# Altium project 姿态记录仪.PrjPcb
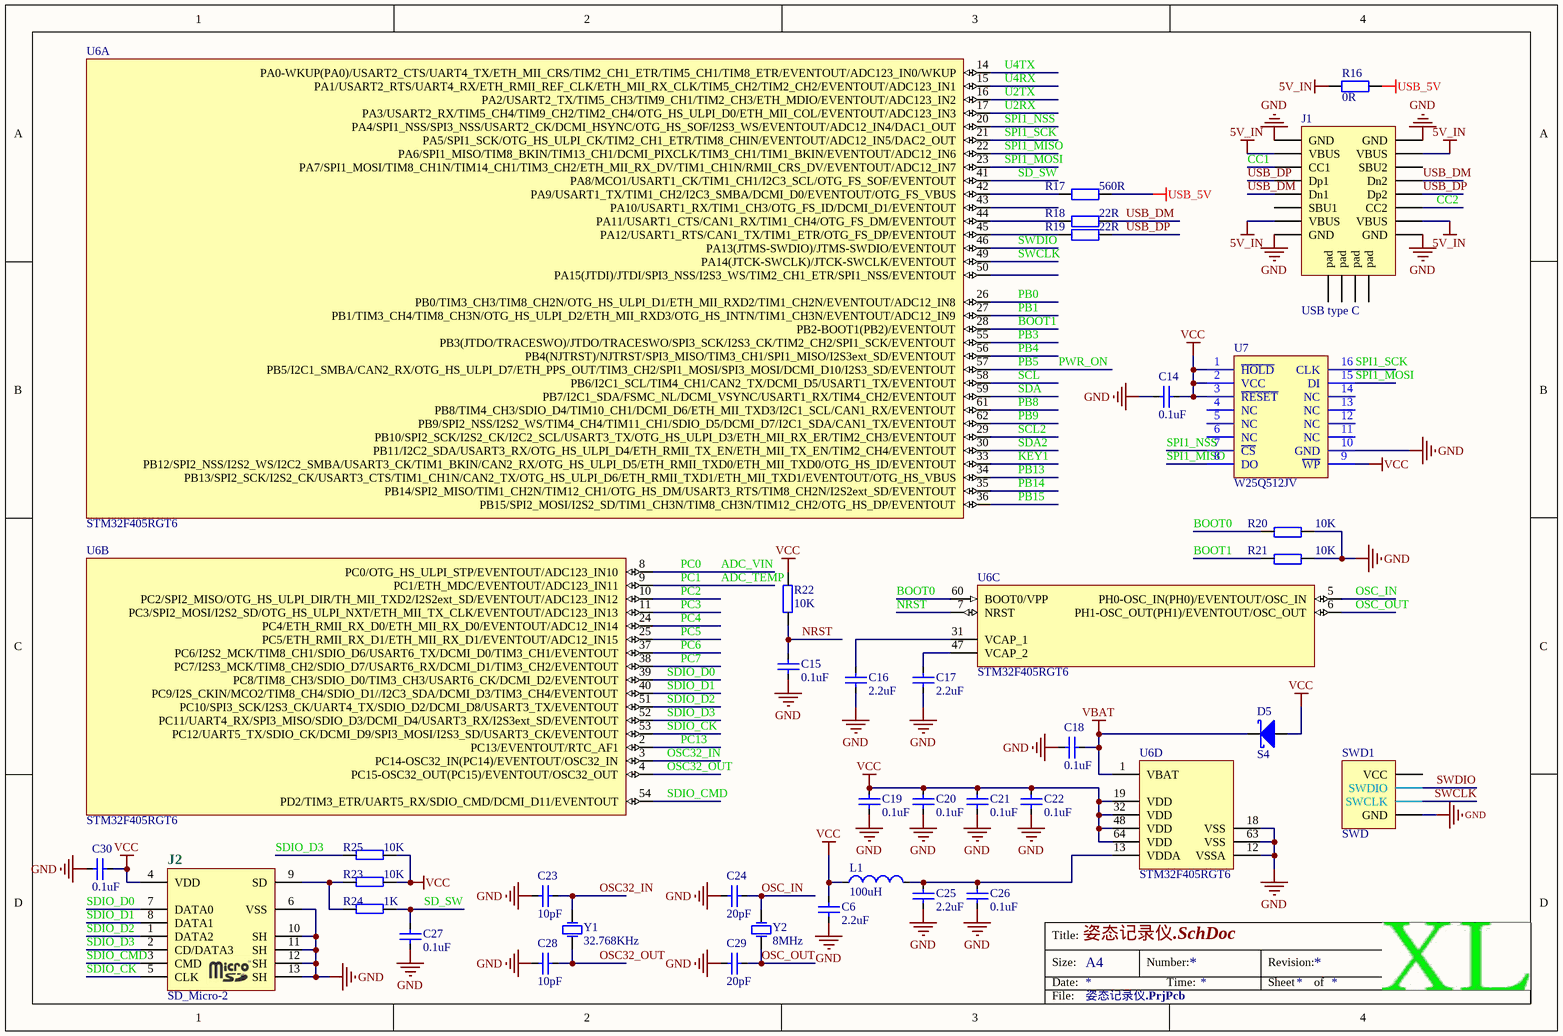
[diagram p0: 姿态记录仪.SchDoc]
2 sheets, 92 parts. Net scope: global (net labels, ports and power ports of the same name join across sheets).
Board file: 姿态记录仪.PcbDoc
Sheets:
  姿态记录仪.SchDoc
  Sensor.SchDoc

## Sheet 姿态记录仪.SchDoc
size A4

### Parts
C6  value 2.2uF  [CAP_0603]  (hidden comment: Cap_0603)
C14  value 0.1uF  [CAP_0603]  (hidden comment: Cap_0603)
C15  value 0.1uF  [CAP_0603]  (hidden comment: Cap_0603)
C16  value 2.2uF  [CAP_0603]  (hidden comment: Cap_0603)
C17  value 2.2uF  [CAP_0603]  (hidden comment: Cap_0603)
C18  value 0.1uF  [CAP_0603]  (hidden comment: Cap_0603)
C19  value 0.1uF  [CAP_0603]  (hidden comment: Cap_0603)
C20  value 0.1uF  [CAP_0603]  (hidden comment: Cap_0603)
C21  value 0.1uF  [CAP_0603]  (hidden comment: Cap_0603)
C22  value 0.1uF  [CAP_0603]  (hidden comment: Cap_0603)
C23  value 10pF  [CAP_0603]  (hidden comment: Cap_0603)
C24  value 20pF  [CAP_0603]  (hidden comment: Cap_0603)
C25  value 2.2uF  [CAP_0603]  (hidden comment: Cap_0603)
C26  value 0.1uF  [CAP_0603]  (hidden comment: Cap_0603)
C27  value 0.1uF  [CAP_0603]  (hidden comment: Cap_0603)
C28  value 10pF  [CAP_0603]  (hidden comment: Cap_0603)
C29  value 20pF  [CAP_0603]  (hidden comment: Cap_0603)
C30  value 0.1uF  [CAP_0603]  (hidden comment: Cap_0603)
D5  S4  [SOD323]
J1  USB type C  [USB Type-C-16Pin_A]
J2  SD_Micro-2  [TF-Miroc_SD_1]
L1  value 100uH  [IND_0603]  (hidden comment: Ind_0603)
R16  value 0R  [RES_0603]  (hidden comment: 1A保险丝)
R17  value 560R  [RES_0603]  (hidden comment: Res_0603)
R18  value 22R  [RES_0603]  (hidden comment: Res_0603)
R19  value 22R  [RES_0603]  (hidden comment: Res_0603)
R20  10K  [RES_0603]
R21  10K  [RES_0603]
R22  10K  [RES_0603]
R23  10K  [RES_0603]
R24  1K  [RES_0603]
R25  10K  [RES_0603]
SWD1  SWD  [BHDR4]
U6  STM32F405RGT6  [TQFP64_V]  (parts A,B,C,D of 4)
U7  W25Q512JV  [SOL-16]
Y1  32.768KHz  [XTAL32]
Y2  8MHz  [XTAL_5032]

### Nets
5V_IN: J1.A4(VBUS) J1.A9(VBUS) J1.B4(VBUS) J1.B9(VBUS) R16.2
GND: C6.1 C14.2 C15.1 C16.1 C17.1 C18.1 C19.1 C20.1 C21.1 C22.1 C23.2 C24.2 C25.1 C26.1 C27.1 C28.2 C29.2 C30.2 J1.A1(GND) J1.A12(GND) J1.B1(GND) J1.B12(GND) J2.6(VSS) J2.10(SH) J2.11(SH) J2.12(SH) J2.13(SH) R20.2 R21.2 SWD1.4(GND) U6.12(VSSA) U6.18(VSS) U6.63(VSS) U7.10(GND) Y1.3(PAD) Y2.3(PAD)
USB_5V: R16.1 R17.2
VBAT: C18.2 D5.2(K) U6.1(VBAT)
VCC: C6.2 C14.1 C19.2 C20.2 C21.2 C22.2 C30.1 D5.1(A) J2.4(VDD) L1.1 R22.1 R23.1 R25.1 U6.19(VDD) U6.32(VDD) U6.48(VDD) U6.64(VDD) U7.1(~{HOLD}) U7.2(VCC) U7.3(~{RESET}) U7.9(~{WP})
ADC_TEMP: U6.9(PC1/ETH_MDC/EVENTOUT/ADC123_IN11)  [also labelled PC1]
ADC_VIN: U6.8(PC0/OTG_HS_ULPI_STP/EVENTOUT/ADC123_IN10)  [also labelled PC0]
BOOT0: R20.1 U6.60(BOOT0/VPP)
BOOT1: R21.1 U6.28(PB2-BOOT1(PB2)/EVENTOUT)
CC1: J1.A5(CC1)
CC2: J1.B5(CC2)
KEY1: U6.33(PB12/SPI2_NSS/I2S2_WS/I2C2_SMBA/USART3_CK/TIM1_BKIN/CAN2_RX/OTG_HS_ULPI_D5/ETH_RMII_TXD0/ETH_MII_TXD0/OTG_HS_ID/EVENTOUT)
NRST: C15.2 R22.2 U6.7(NRST)
OSC32_IN: C23.1 U6.3(PC14-OSC32_IN(PC14)/EVENTOUT/OSC32_IN) Y1.1(OSC1)
OSC32_OUT: C28.1 U6.4(PC15-OSC32_OUT(PC15)/EVENTOUT/OSC32_OUT) Y1.2(OSC2)
OSC_IN: C24.1 U6.5(PH0-OSC_IN(PH0)/EVENTOUT/OSC_IN) Y2.1(OSC1)
OSC_OUT: C29.1 U6.6(PH1-OSC_OUT(PH1)/EVENTOUT/OSC_OUT) Y2.2(OSC2)
PB0: U6.26(PB0/TIM3_CH3/TIM8_CH2N/OTG_HS_ULPI_D1/ETH_MII_RXD2/TIM1_CH2N/EVENTOUT/ADC12_IN8)
PB1: U6.27(PB1/TIM3_CH4/TIM8_CH3N/OTG_HS_ULPI_D2/ETH_MII_RXD3/OTG_HS_INTN/TIM1_CH3N/EVENTOUT/ADC12_IN9)
PB3: U6.55(PB3(JTDO/TRACESWO)/JTDO/TRACESWO/SPI3_SCK/I2S3_CK/TIM2_CH2/SPI1_SCK/EVENTOUT)
PB4: U6.56(PB4(NJTRST)/NJTRST/SPI3_MISO/TIM3_CH1/SPI1_MISO/I2S3ext_SD/EVENTOUT)
PB5: U6.57(PB5/I2C1_SMBA/CAN2_RX/OTG_HS_ULPI_D7/ETH_PPS_OUT/TIM3_CH2/SPI1_MOSI/SPI3_MOSI/DCMI_D10/I2S3_SD/EVENTOUT)  [also labelled PWR_ON]
PB8: U6.61(PB8/TIM4_CH3/SDIO_D4/TIM10_CH1/DCMI_D6/ETH_MII_TXD3/I2C1_SCL/CAN1_RX/EVENTOUT)
PB9: U6.62(PB9/SPI2_NSS/I2S2_WS/TIM4_CH4/TIM11_CH1/SDIO_D5/DCMI_D7/I2C1_SDA/CAN1_TX/EVENTOUT)
PB13: U6.34(PB13/SPI2_SCK/I2S2_CK/USART3_CTS/TIM1_CH1N/CAN2_TX/OTG_HS_ULPI_D6/ETH_RMII_TXD1/ETH_MII_TXD1/EVENTOUT/OTG_HS_VBUS)
PB14: U6.35(PB14/SPI2_MISO/TIM1_CH2N/TIM12_CH1/OTG_HS_DM/USART3_RTS/TIM8_CH2N/I2S2ext_SD/EVENTOUT)
PB15: U6.36(PB15/SPI2_MOSI/I2S2_SD/TIM1_CH3N/TIM8_CH3N/TIM12_CH2/OTG_HS_DP/EVENTOUT)
PC2: U6.10(PC2/SPI2_MISO/OTG_HS_ULPI_DIR/TH_MII_TXD2/I2S2ext_SD/EVENTOUT/ADC123_IN12)
PC3: U6.11(PC3/SPI2_MOSI/I2S2_SD/OTG_HS_ULPI_NXT/ETH_MII_TX_CLK/EVENTOUT/ADC123_IN13)
PC4: U6.24(PC4/ETH_RMII_RX_D0/ETH_MII_RX_D0/EVENTOUT/ADC12_IN14)
PC5: U6.25(PC5/ETH_RMII_RX_D1/ETH_MII_RX_D1/EVENTOUT/ADC12_IN15)
PC6: U6.37(PC6/I2S2_MCK/TIM8_CH1/SDIO_D6/USART6_TX/DCMI_D0/TIM3_CH1/EVENTOUT)
PC7: U6.38(PC7/I2S3_MCK/TIM8_CH2/SDIO_D7/USART6_RX/DCMI_D1/TIM3_CH2/EVENTOUT)
PC13: U6.2(PC13/EVENTOUT/RTC_AF1)
SCL: U6.58(PB6/I2C1_SCL/TIM4_CH1/CAN2_TX/DCMI_D5/USART1_TX/EVENTOUT)
SCL2: U6.29(PB10/SPI2_SCK/I2S2_CK/I2C2_SCL/USART3_TX/OTG_HS_ULPI_D3/ETH_MII_RX_ER/TIM2_CH3/EVENTOUT)
SD_SW: C27.2 R24.1 U6.41(PA8/MCO1/USART1_CK/TIM1_CH1/I2C3_SCL/OTG_FS_SOF/EVENTOUT)
SDA: U6.59(PB7/I2C1_SDA/FSMC_NL/DCMI_VSYNC/USART1_RX/TIM4_CH2/EVENTOUT)
SDA2: U6.30(PB11/I2C2_SDA/USART3_RX/OTG_HS_ULPI_D4/ETH_RMII_TX_EN/ETH_MII_TX_EN/TIM2_CH4/EVENTOUT)
SDIO_CK: J2.5(CLK) U6.53(PC12/UART5_TX/SDIO_CK/DCMI_D9/SPI3_MOSI/I2S3_SD/USART3_CK/EVENTOUT)
SDIO_CMD: J2.3(CMD) U6.54(PD2/TIM3_ETR/UART5_RX/SDIO_CMD/DCMI_D11/EVENTOUT)
SDIO_D0: J2.7(DATA0) U6.39(PC8/TIM8_CH3/SDIO_D0/TIM3_CH3/USART6_CK/DCMI_D2/EVENTOUT)
SDIO_D1: J2.8(DATA1) U6.40(PC9/I2S_CKIN/MCO2/TIM8_CH4/SDIO_D1//I2C3_SDA/DCMI_D3/TIM3_CH4/EVENTOUT)
SDIO_D2: J2.1(DATA2) U6.51(PC10/SPI3_SCK/I2S3_CK/UART4_TX/SDIO_D2/DCMI_D8/USART3_TX/EVENTOUT)
SDIO_D3: J2.2(CD/DATA3) R25.2 U6.52(PC11/UART4_RX/SPI3_MISO/SDIO_D3/DCMI_D4/USART3_RX/I2S3ext_SD/EVENTOUT)
SPI1_MISO: U6.22(PA6/SPI1_MISO/TIM8_BKIN/TIM13_CH1/DCMI_PIXCLK/TIM3_CH1/TIM1_BKIN/EVENTOUT/ADC12_IN6) U7.8(DO)
SPI1_MOSI: U6.23(PA7/SPI1_MOSI/TIM8_CH1N/TIM14_CH1/TIM3_CH2/ETH_MII_RX_DV/TIM1_CH1N/RMII_CRS_DV/EVENTOUT/ADC12_IN7) U7.15(DI)
SPI1_NSS: U6.20(PA4/SPI1_NSS/SPI3_NSS/USART2_CK/DCMI_HSYNC/OTG_HS_SOF/I2S3_WS/EVENTOUT/ADC12_IN4/DAC1_OUT) U7.7(~{CS})
SPI1_SCK: U6.21(PA5/SPI1_SCK/OTG_HS_ULPI_CK/TIM2_CH1_ETR/TIM8_CHIN/EVENTOUT/ADC12_IN5/DAC2_OUT) U7.16(CLK)
SWCLK: SWD1.3(SWCLK) U6.49(PA14(JTCK-SWCLK)/JTCK-SWCLK/EVENTOUT)
SWDIO: SWD1.2(SWDIO) U6.46(PA13(JTMS-SWDIO)/JTMS-SWDIO/EVENTOUT)
U2RX: U6.17(PA3/USART2_RX/TIM5_CH4/TIM9_CH2/TIM2_CH4/OTG_HS_ULPI_D0/ETH_MII_COL/EVENTOUT/ADC123_IN3)
U2TX: U6.16(PA2/USART2_TX/TIM5_CH3/TIM9_CH1/TIM2_CH3/ETH_MDIO/EVENTOUT/ADC123_IN2)
U4RX: U6.15(PA1/USART2_RTS/UART4_RX/ETH_RMII_REF_CLK/ETH_MII_RX_CLK/TIM5_CH2/TIM2_CH2/EVENTOUT/ADC123_IN1)
U4TX: U6.14(PA0-WKUP(PA0)/USART2_CTS/UART4_TX/ETH_MII_CRS/TIM2_CH1_ETR/TIM5_CH1/TIM8_ETR/EVENTOUT/ADC123_IN0/WKUP)
USB_DM: J1.A7(Dn1) J1.B7(Dn2) R18.2
USB_DP: J1.A6(Dp1) J1.B6(Dp2) R19.2
NetC16_2: C16.2 U6.31(VCAP_1)
NetC17_2: C17.2 U6.47(VCAP_2)
NetC25_2: C25.2 C26.2 L1.2 U6.13(VDDA)
NetJ2_9: J2.9(SD) R23.2 R24.2
NetR17_1: R17.1 U6.42(PA9/USART1_TX/TIM1_CH2/I2C3_SMBA/DCMI_D0/EVENTOUT/OTG_FS_VBUS)
NetR18_1: R18.1 U6.44(PA11/USART1_CTS/CAN1_RX/TIM1_CH4/OTG_FS_DM/EVENTOUT)
NetR19_1: R19.1 U6.45(PA12/USART1_RTS/CAN1_TX/TIM1_ETR/OTG_FS_DP/EVENTOUT)

Not connected (* = marked no-connect by the designer): J1 0(pad) A8(SBU1) B8(SBU2); SWD1 1(VCC); U6 43(PA10/USART1_RX/TIM1_CH3/OTG_FS_ID/DCMI_D1/EVENTOUT) 50(PA15(JTDI)/JTDI/SPI3_NSS/I2S3_WS/TIM2_CH1_ETR/SPI1_NSS/EVENTOUT); U7 4(NC) 5(NC) 6(NC) 11(NC) 12(NC) 13(NC) 14(NC)

### Notes on the sheet
- Title:
- Size:
- Date:
- A4
- Number:
- Time:
- Revision:
- Sheet
- of
- File:

### Library data of the parts
C6 C14-C30 = Cap_0603: Capacitor
D5 = S4: 1N5819,Low-power general purpose voltageregulator diodes in a small plasticSMD SOD323 package; Value: S4
J1 = USB_C
L1 = Ind_0603: Inductor
R16 = Res2: Resistor; Published: 8-Jun-2000; LatestRevisionDate: 17-Jul-2002; LatestRevisionNote: Re-released for DXP Platform.; PackageReference: AXIAL-0.4; Publisher: Altium Limited
R17-R19 = Res_0603: Resistor
R20-R25 = R
SWD1 = SWD: JLINK,SWD; LatestRevisionDate: 17-Jul-2002; LatestRevisionNote: Re-released for DXP Platform.; Publisher: Altium Limited
U6 = STM32F405RGT6: ARM Cortex-M4 32b MCU+FPU, 210DMIP, 1024 kB Flash, 192+4 kB RAM, 51 I/Os, 64-pin LQFP, -40 to +85癈, Tray; Internal RAM: 192kB; Operating Frequency (Processor Speed): 168MHz; A/D Converter: 16x12-bit; D/A Converter: 2x12-bit; 16-bit Timers (IC/OC/PWM): 12x16-bit(24/24/30); 32-bit Timer (IC/OC/PWM): 2x32-bit (8/8/8); Other Timer Functions: 2xWDG, RTC, 24-bit down counter; Serial Interface: 3xSPI/2xI2S/2xI2C/3xUSART(IrDa, ISO7816)/3xUART/1xUSB OTG FS/HS, 2xCAN/ SDIO; DatasheetVersion: rev2, Jan-2012; PackageVersion: 2012; PackageReference: TQFP64; PackageDescription: 64-Pin Low Profile Quad Flat Package, 10x10 mm Body, 0.5 mm Pitch; ComponentLink1Description: Manufacturer URL; ComponentLink1URL: http://www.st.com/; ComponentLink2Description: STM32F405/7 Datasheet; ComponentLink2URL: http://www.st.com/internet/com/TECHNICAL_RESOURCES/TECHNICAL_LITERATURE/DATASHEET/DM00037051.pdf; ComponentLink3Description: STM32F4 Web Page; ComponentLink3URL: http://www.st.com/internet/mcu/subclass/1521.jsp
Y1 = XTAL_4.9152M: Crystal Oscillator; Published: 8-Jun-2000; LatestRevisionDate: 17-Jul-2002; LatestRevisionNote: Re-released for DXP Platform.; Publisher: Altium Limited
Y2 = XTAL_8.0M: Crystal Oscillator; Published: 8-Jun-2000; LatestRevisionDate: 17-Jul-2002; LatestRevisionNote: Re-released for DXP Platform.; Publisher: Altium Limited; Value: 8MHz
U7 = W25Q512JV: Value: W25Q512JV

## Sheet Sensor.SchDoc
size A4
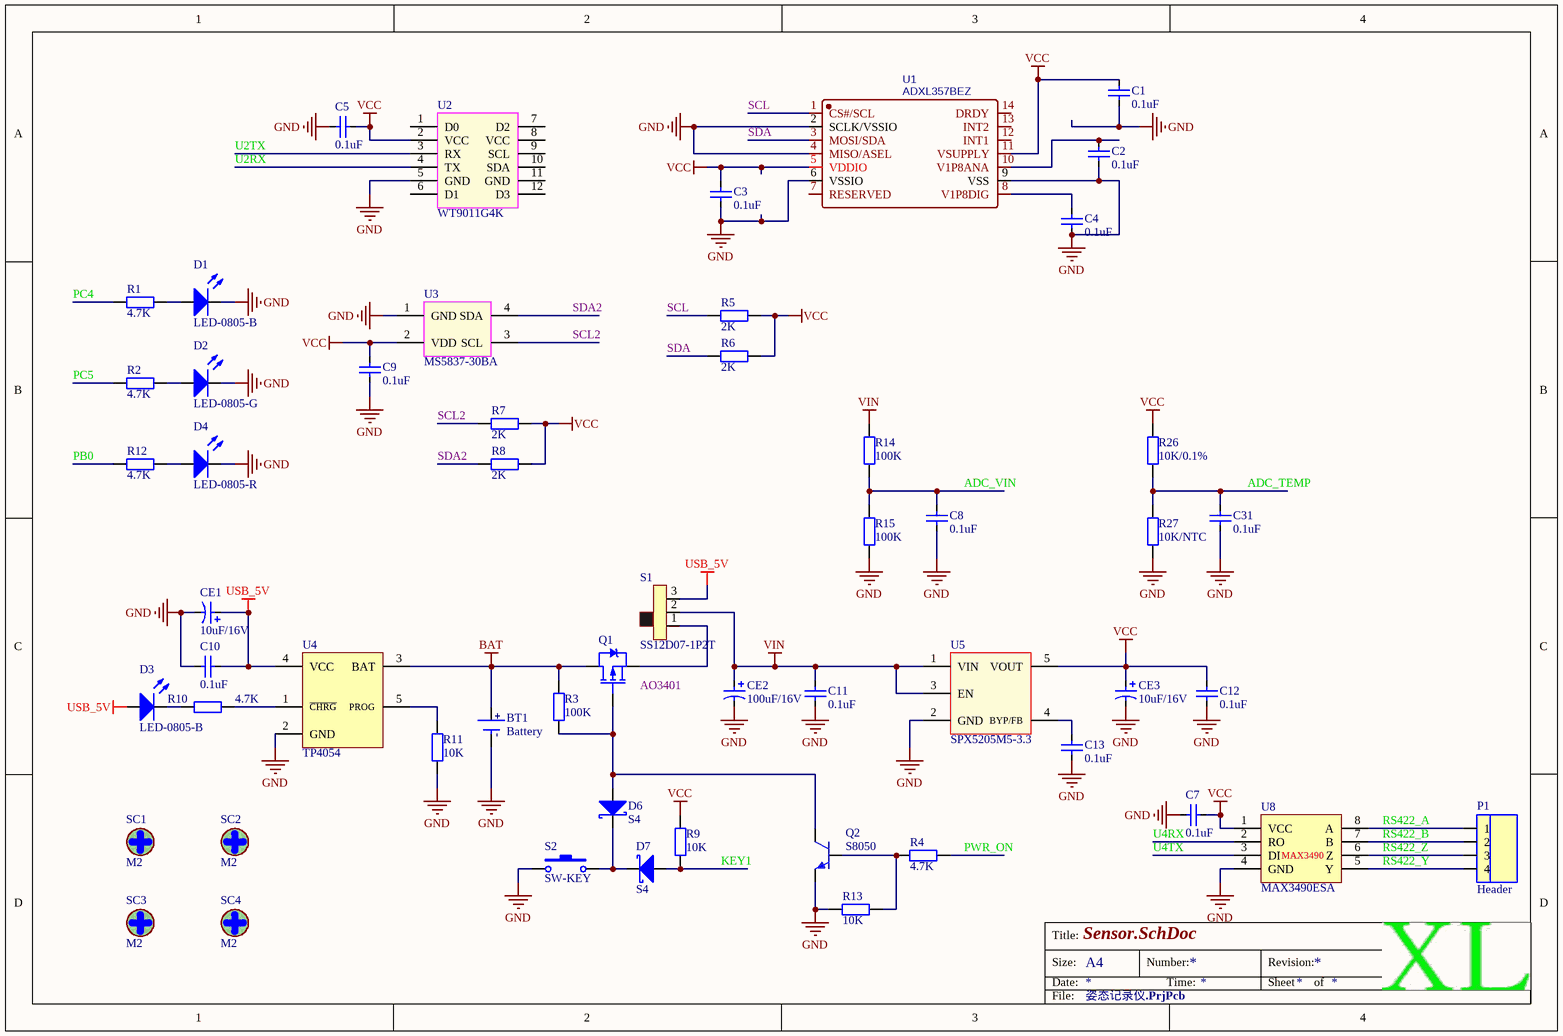
[diagram p1: Sensor.SchDoc]

### Parts
BT1  Battery  [BHDR2]
C1  value 0.1uF  [CAP_0603]  (hidden comment: Cap_0603)
C2  value 0.1uF  [CAP_0603]  (hidden comment: Cap_0603)
C3  value 0.1uF  [CAP_0603]  (hidden comment: Cap_0603)
C4  value 0.1uF  [CAP_0603]  (hidden comment: Cap_0603)
C5  value 0.1uF  [CAP_0603]  (hidden comment: Cap_0603)
C7  value 0.1uF  [CAP_0603]  (hidden comment: Cap_0603)
C8  value 0.1uF  [CAP_0603]  (hidden comment: Cap_0603)
C9  value 0.1uF  [CAP_0603]  (hidden comment: Cap_0603)
C10  value 0.1uF  [CAP_0603]  (hidden comment: Cap_0603)
C11  value 0.1uF  [CAP_0603]  (hidden comment: Cap_0603)
C12  value 0.1uF  [CAP_0603]  (hidden comment: Cap_0603)
C13  value 0.1uF  [CAP_0603]  (hidden comment: Cap_0603)
C31  value 0.1uF  [CAP_0603]  (hidden comment: Cap_0603)
CE1  value 10uF/16V  [CAP_ELEC_AL_4x5]  (hidden comment: CAP POL)
CE2  value 100uF/16V  [CAP_ELEC_AL_6.3x4.2]  (hidden comment: CAP POL)
CE3  value 10uF/16V  [CAP_ELEC_AL_4x5]  (hidden comment: CAP POL)
D1  value LED-0805-B  [LED_0805_B]  (hidden comment: LED_0805)
D2  value LED-0805-G  [LED_0805_G]  (hidden comment: LED_0805)
D3  value LED-0805-B  [LED_0805_B]  (hidden comment: LED_0805)
D4  value LED-0805-R  [LED_0805_R]  (hidden comment: LED_0805)
D6  S4  [SOD323]
D7  S4  [SOD323]
P1  Header  [BHDR4]
Q1  AO3401  [SOT-23-XL]
Q2  S8050  [SOT-23-XL]
R1  value 4.7K  [RES_0603]  (hidden comment: Res_0603)
R2  value 4.7K  [RES_0603]  (hidden comment: Res_0603)
R3  value 100K  [RES_0603]  (hidden comment: Res_0603)
R4  value 4.7K  [RES_0603]  (hidden comment: Res_0603)
R5  value 2K  [RES_0603]  (hidden comment: Res_0603)
R6  value 2K  [RES_0603]  (hidden comment: Res_0603)
R7  value 2K  [RES_0603]  (hidden comment: Res_0603)
R8  value 2K  [RES_0603]  (hidden comment: Res_0603)
R9  value 10K  [RES_0603]  (hidden comment: Res_0603)
R10  value 4.7K  [RES_0603]  (hidden comment: Res_0603)
R11  value 10K  [RES_0603]  (hidden comment: Res_0603)
R12  value 4.7K  [RES_0603]  (hidden comment: Res_0603)
R13  value 10K  [RES_0603]  (hidden comment: Res_0603)
R14  value 100K  [RES_0603]  (hidden comment: Res_0603)
R15  value 100K  [RES_0603]  (hidden comment: Res_0603)
R26  value 10K/0.1%  [RES_0805]  (hidden comment: Res_0805)
R27  value 10K/NTC  [NTC-MF52]  (hidden comment: Res_0603)
S1  SS12D07-1P2T  [SS12D07-XL]
S2  SW-KEY  [KEY4-180-XL]
SC1  M2  [MARK-2.0MM]
SC2  M2  [MARK-2.0MM]
SC3  M2  [MARK-2.0MM]
SC4  M2  [MARK-2.0MM]
U1  ADXL357BEZ  [LCC-14_L6.0-W6.0-P1.27-TL]
U2  WT9011G4K  [WT9011G4K]
U3  MS5837-30BA  [MS5837]
U4  TP4054  [SOT-23-5]
U5  value SPX5205M5-3.3  [SOT23-5]  (hidden comment: SPX5205M-L-3-3)
U8  MAX3490ESA  [SOP8-XL]

### Nets
BAT: BT1.1(+) Q1.3(D) R3.2 U4.3(BAT)
GND: BT1.2(-) C1.1 C2.1 C3.1 C4.1 C5.2 C7.2 C8.1 C9.1 C10.2 C11.1 C12.1 C13.1 C31.1 CE1.2 CE2.2 CE3.2 D1.2(K) D2.2(K) D4.2(K) Q2.2(E) R11.1 R13.2 R15.1 R27.1 S2.1 U1.2(SCLK/VSSIO) U1.4(MISO/ASEL) U1.6(VSSIO) U1.9(VSS) U2.5(GND) U3.1(GND) U4.2(GND) U5.2(GND) U8.4(GND)
PE: SC1.0(PE) SC2.0(PE) SC3.0(PE) SC4.0(PE)
USB_5V: C10.1 CE1.1 D3.1(A) S1.3(S3) U4.4(VCC)
VCC: C1.2 C3.2 C5.1 C7.1 C9.2 C12.2 CE3.1 R5.2 R6.2 R7.2 R8.2 R9.2 R26.2 U1.5(VDDIO) U1.11(VSUPPLY) U2.2(VCC) U3.2(VDD) U5.5(VOUT) U8.1(VCC)
VIN: C11.2 CE2.1 R14.2 S1.2(S2) U5.1(VIN) U5.3(EN)
ADC_TEMP: C31.2 R26.1 R27.2
ADC_VIN: C8.2 R14.1 R15.2
KEY1: D7.1(A) R9.1
PB0: R12.1
PC4: R1.1
PC5: R2.1
PWR_ON: R4.1  [project net PB5]
RS422_A: P1.1 U8.8(A)
RS422_B: P1.2 U8.7(B)
RS422_Y: P1.4 U8.5(Y)
RS422_Z: P1.3 U8.6(Z)
SCL: R5.1 U1.1(CS#/SCL)
SCL2: R7.1 U3.3(SCL)
SDA: R6.1 U1.3(MOSI/SDA)
SDA2: R8.1 U3.4(SDA)
U2RX: U2.4(TX)
U2TX: U2.3(RX)
U4RX: U8.2(RO)
U4TX: U8.3(DI)
NetC2_2: C2.2 U1.10(V1P8ANA)
NetC4_2: C4.2 U1.8(V1P8DIG)
NetC13_2: C13.2 U5.4(BYP/FB)
NetD1_1: D1.1(A) R1.2
NetD2_1: D2.1(A) R2.2
NetD3_2: D3.2(K) R10.2
NetD4_1: D4.1(A) R12.2
NetD6_1: D6.1(A) Q1.1(G) Q2.3(C) R3.1
NetD6_2: D6.2(K) D7.2(K) S2.2
NetQ1_2: Q1.2(S) S1.1(S1)
NetQ2_1: Q2.1(B) R4.2 R13.1
NetR10_1: R10.1 U4.1(~{CHRG})
NetR11_2: R11.2 U4.5(PROG)

Not connected (* = marked no-connect by the designer): U1 7(RESERVED) 12(INT1) 13(INT2) 14(DRDY); U2 1(D0) 6(D1) 7(D2) 8(VCC) 9(SCL) 10(SDA) 11(GND) 12(D3)

### Notes on the sheet
- Title:
- Size:
- Date:
- A4
- Number:
- Time:
- Revision:
- Sheet
- of
- File:

### Library data of the parts
BT1 = Battery1: Multicell Battery; Published: 24-Mar-1999; LatestRevisionDate: 17-Jul-2002; LatestRevisionNote: Re-released for DXP Platform.; PackageReference: BAT-2; Publisher: Altium Limited
C1-C5 C7-C13 C31 = Cap_0603: Capacitor
CE1-CE3 = CAP POL: 电解电容
D1-D4 = LED_0805: LED
D6 D7 = S4: as D5 on sheet 姿态记录仪; Value: S4
P1 = Header 4: Header, 2-Pin; LatestRevisionDate: 17-Jul-2002; LatestRevisionNote: Re-released for DXP Platform.; Publisher: Altium Limited
Q1 = AO3401: PMOS,SOT23,-30V,3A; Value: AO3401
Q2 = S8050: NPN; Value: S8050
R1-R15 R27 = Res_0603: Resistor
R26 = Res_0805: Resistor
S1 = SS12D07: SW,SS12D07; Value: SS12D07
S2 = SW-KEY: Switch; Published: 24-Mar-1999; LatestRevisionDate: 17-Jul-2002; LatestRevisionNote: Re-released for DXP Platform.; PackageReference: SPST-2; Publisher: Altium Limited; PackageDescription: Switch; 2 Leads
SC1-SC4 = Screw_M3: Screw M3, MARK; Value: M3
U1 = ADXL357BEZ: BOM_Manufacturer: Analog Devices; Contributor: LCSC; BOM_Supplier: LCSC; BOM_Supplier Part: C579462; BOM_Manufacturer Part: ADXL357BEZ; BOM_JLCPCB Part Class: Extended Part; spicePre: U; spiceSymbolName: ADXL357BEZ
U5 = SPX5205M-L-3-3: LDO,RC33
U8 = MAX3490: RS422; Value: MAX3490ESA
U2 = WT9011G4K: Value: *
U4 = TP4054: Value: TP4054

## Nets that join several sheets
GND: 姿态记录仪 (36 pins), Sensor (35 pins)
USB_5V: 姿态记录仪 (R16.1 R17.2), Sensor (5 pins)
VCC: 姿态记录仪 (21 pins), Sensor (19 pins)
ADC_TEMP: 姿态记录仪 (U6.9), Sensor (C31.2 R26.1 R27.2)
ADC_VIN: 姿态记录仪 (U6.8), Sensor (C8.2 R14.1 R15.2)
KEY1: 姿态记录仪 (U6.33), Sensor (D7.1 R9.1)
PB0: 姿态记录仪 (U6.26), Sensor (R12.1)
PB5: 姿态记录仪 (U6.57), Sensor (R4.1)
PC4: 姿态记录仪 (U6.24), Sensor (R1.1)
PC5: 姿态记录仪 (U6.25), Sensor (R2.1)
SCL: 姿态记录仪 (U6.58), Sensor (R5.1 U1.1)
SCL2: 姿态记录仪 (U6.29), Sensor (R7.1 U3.3)
SDA: 姿态记录仪 (U6.59), Sensor (R6.1 U1.3)
SDA2: 姿态记录仪 (U6.30), Sensor (R8.1 U3.4)
U2RX: 姿态记录仪 (U6.17), Sensor (U2.4)
U2TX: 姿态记录仪 (U6.16), Sensor (U2.3)
U4RX: 姿态记录仪 (U6.15), Sensor (U8.2)
U4TX: 姿态记录仪 (U6.14), Sensor (U8.3)